# EAGLE schematic PT_2017_PB_4lyr_Rev1 (EAGLE 6.5.0)
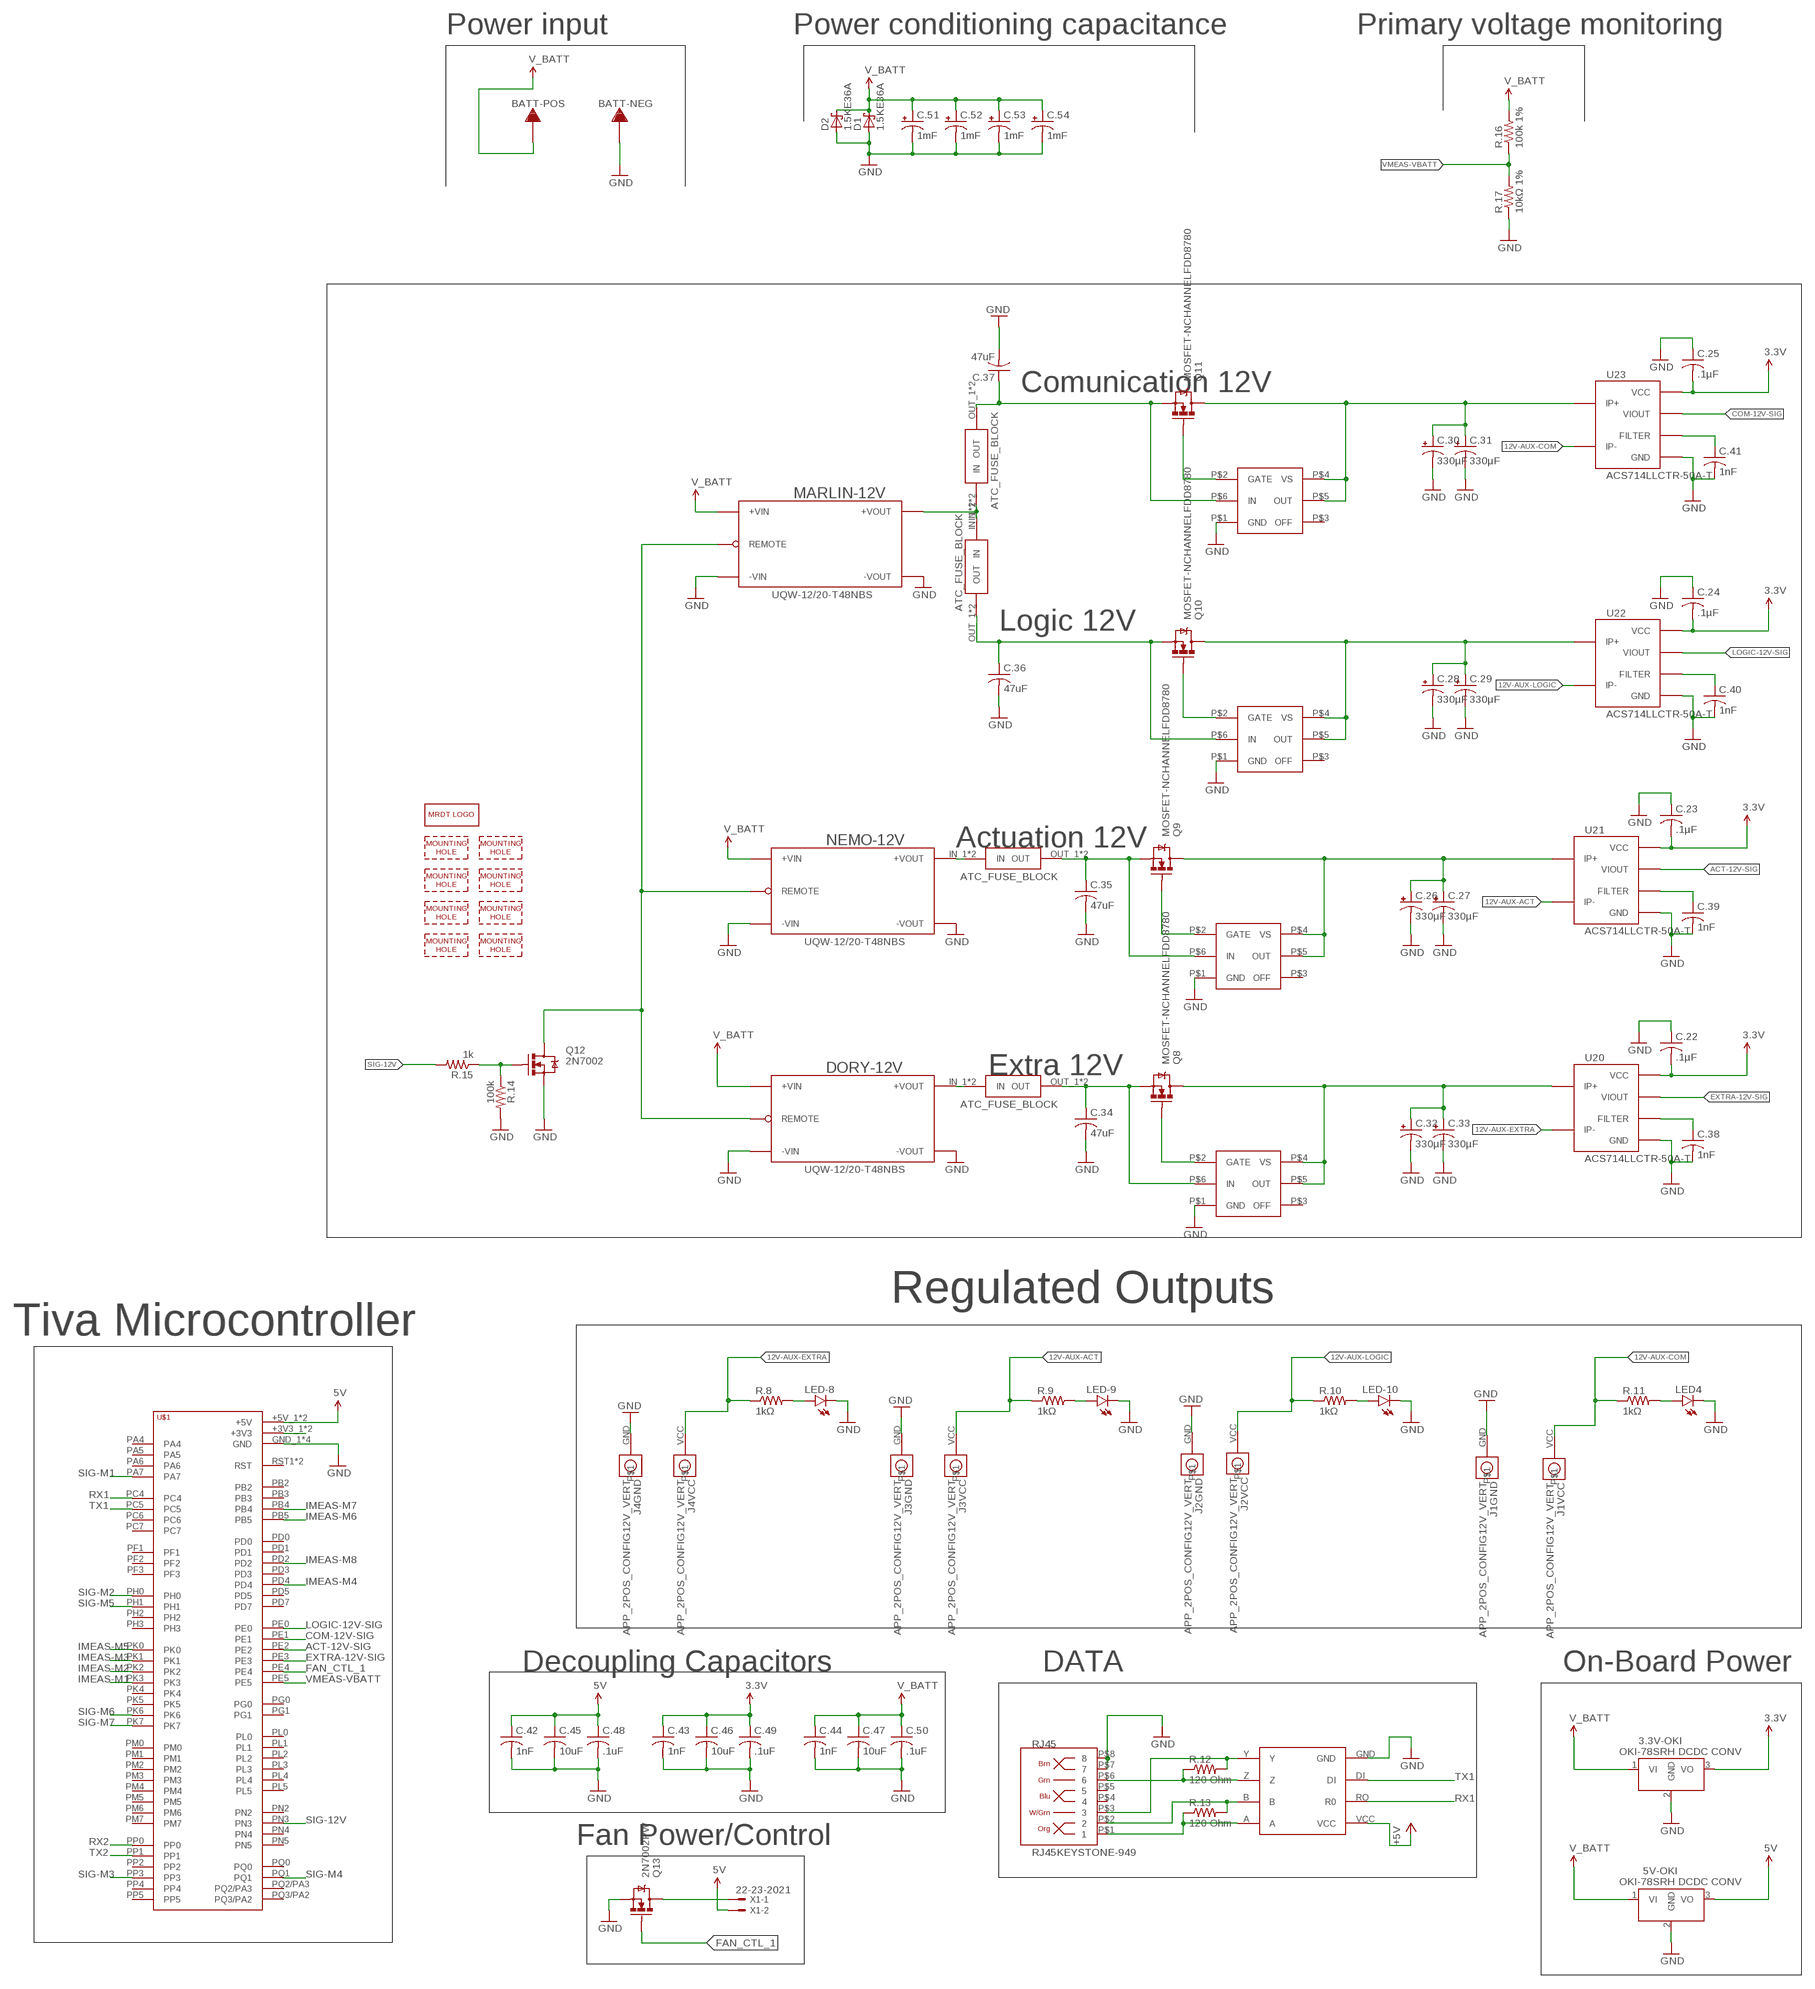
[diagram p0: schematic, sheet 1, part 1 of 2]
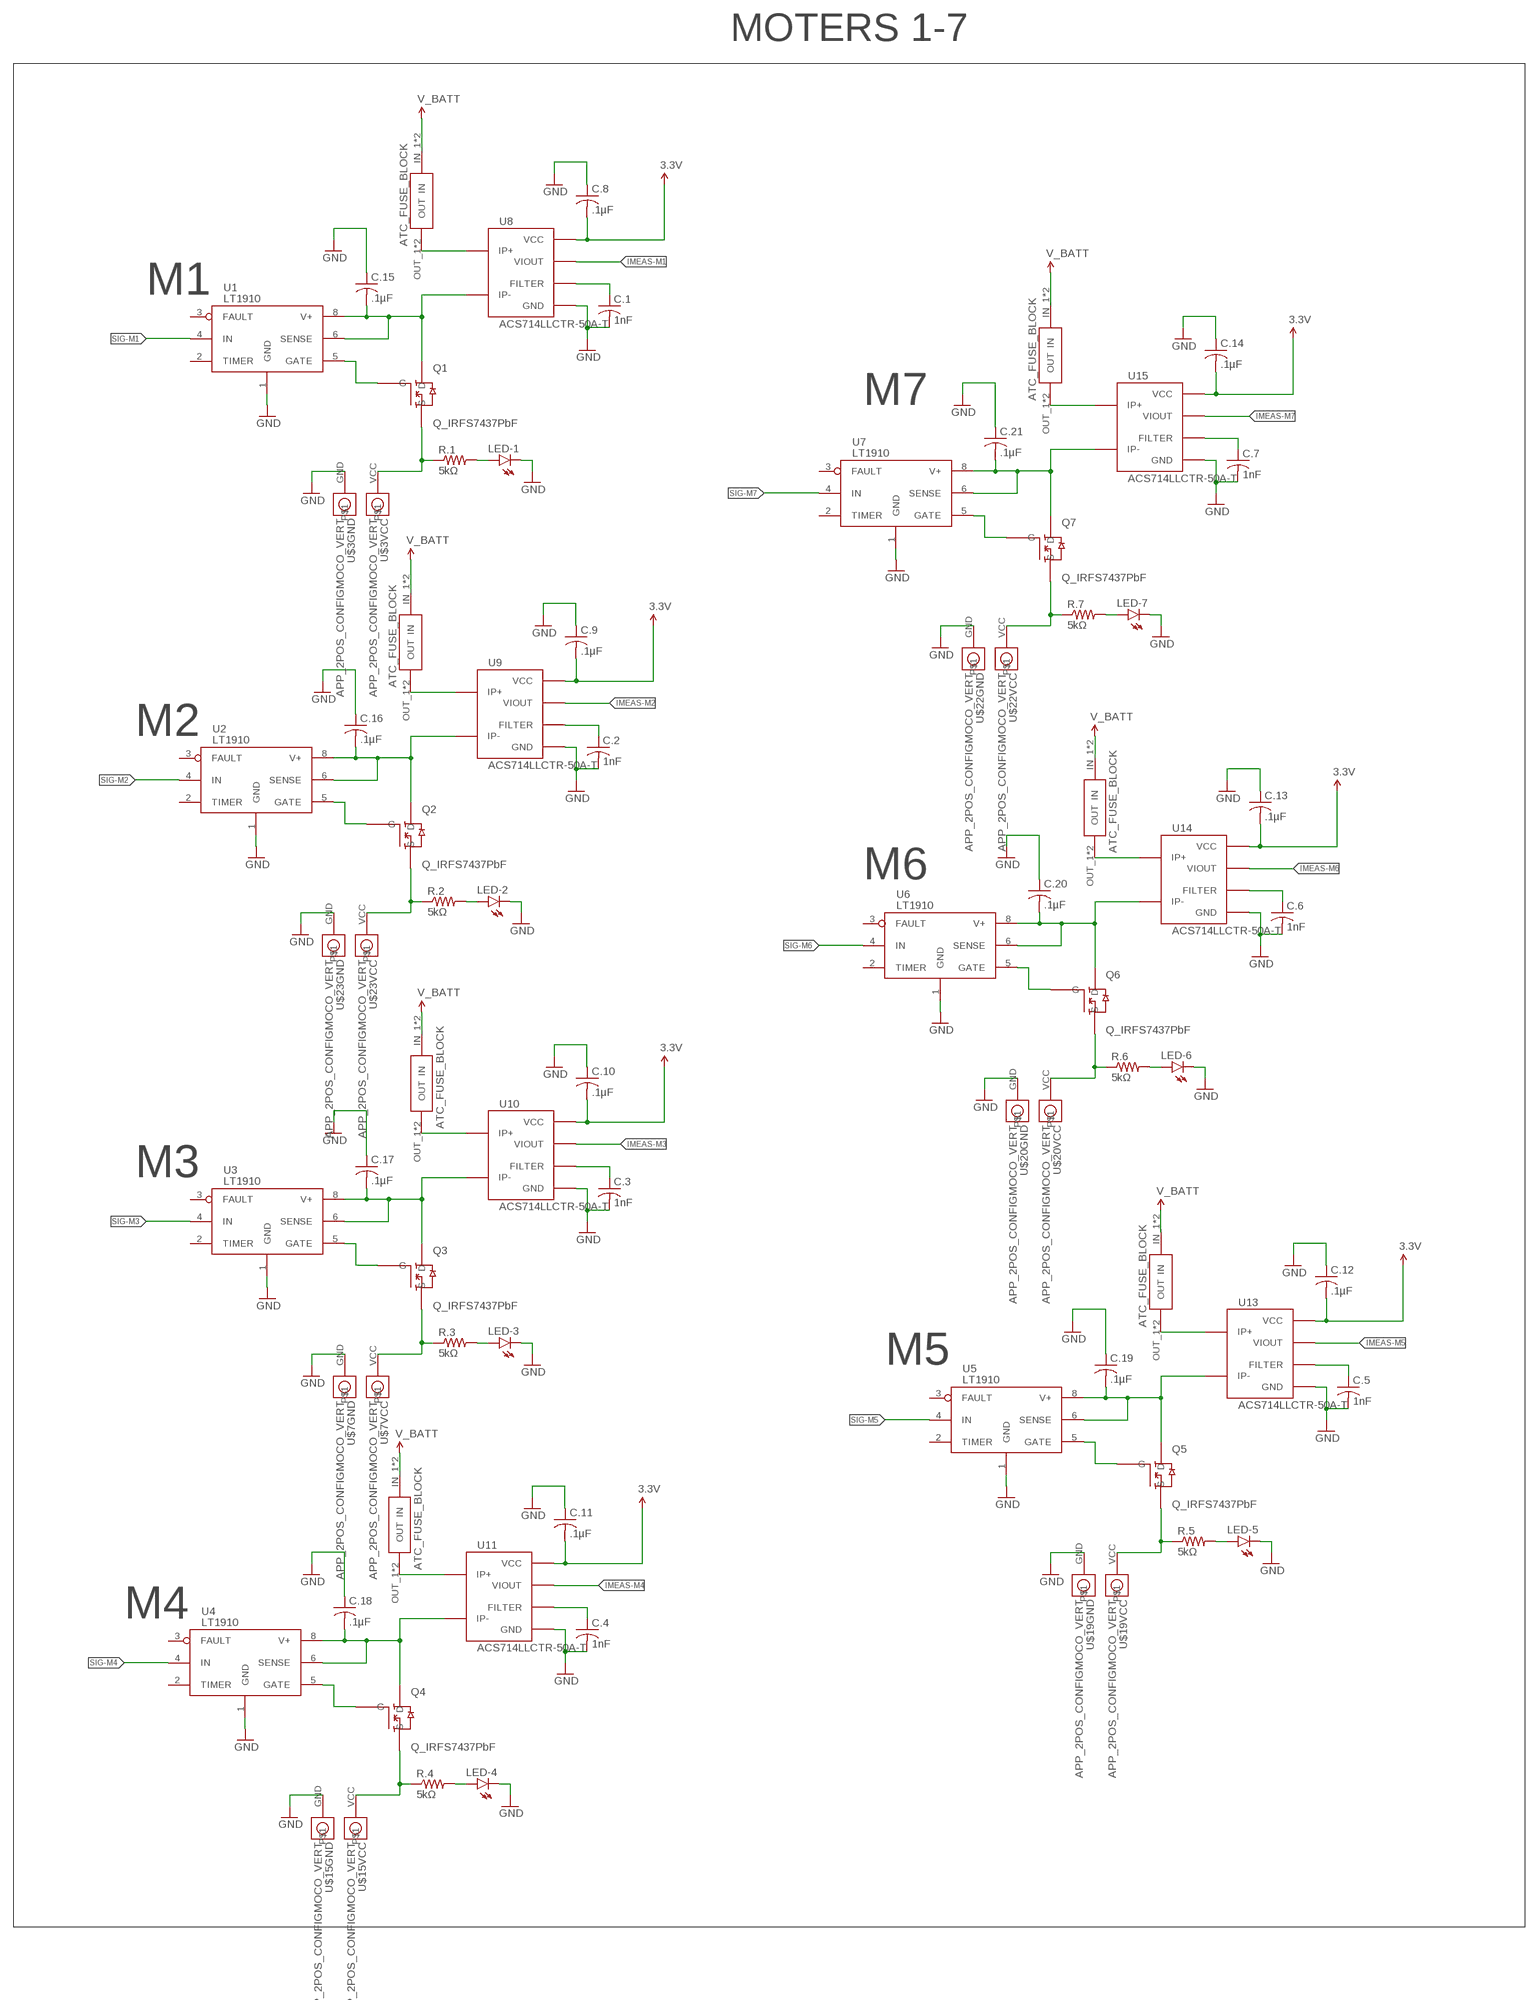
[diagram p1: schematic, sheet 1, part 2 of 2]

## Parts
3.3V-OKI  Q_OKI-78SR  [OKI-78SR_HORIZ]
5V-OKI  Q_OKI-78SR  [OKI-78SR_HORIZ]
BATT-NEG  TERMINAL_HOLE  [LARGE_TERMINAL_HOLE]
BATT-POS  TERMINAL_HOLE  [LARGE_TERMINAL_HOLE]
C.1  1nF  C-USC1206  [C1206]
C.2  1nF  C-USC1206  [C1206]
C.3  1nF  C-USC1206  [C1206]
C.4  1nF  C-USC1206  [C1206]
C.5  1nF  C-USC1206  [C1206]
C.6  1nF  C-USC1206  [C1206]
C.7  1nF  C-USC1206  [C1206]
C.8  .1µF  C-USC1206  [C1206]
C.9  .1µF  C-USC1206  [C1206]
C.10  .1µF  C-USC1206  [C1206]
C.11  .1µF  C-USC1206  [C1206]
C.12  .1µF  C-USC1206  [C1206]
C.13  .1µF  C-USC1206  [C1206]
C.14  .1µF  C-USC1206  [C1206]
C.15  .1µF  C-USC1206  [C1206]
C.16  .1µF  C-USC1206  [C1206]
C.17  .1µF  C-USC1206  [C1206]
C.18  .1µF  C-USC1206  [C1206]
C.19  .1µF  C-USC1206  [C1206]
C.20  .1µF  C-USC1206  [C1206]
C.21  .1µF  C-USC1206  [C1206]
C.22  .1µF  C-USC1206  [C1206]
C.23  .1µF  C-USC1206  [C1206]
C.24  .1µF  C-USC1206  [C1206]
C.25  .1µF  C-USC1206  [C1206]
C.26  330µF  CPOL-USE5-8.5  [E5-8,5]
C.27  330µF  CPOL-USE5-8.5  [E5-8,5]
C.28  330µF  CPOL-USE5-8.5  [E5-8,5]
C.29  330µF  CPOL-USE5-8.5  [E5-8,5]
C.30  330µF  CPOL-USE5-8.5  [E5-8,5]
C.31  330µF  CPOL-USE5-8.5  [E5-8,5]
C.32  330µF  CPOL-USE5-8.5  [E5-8,5]
C.33  330µF  CPOL-USE5-8.5  [E5-8,5]
C.34  47uF  C-USC1206  [C1206]
C.35  47uF  C-USC1206  [C1206]
C.36  47uF  C-USC1206  [C1206]
C.37  47uF  C-USC1206  [C1206]
C.38  1nF  C-USC1206  [C1206]
C.39  1nF  C-USC1206  [C1206]
C.40  1nF  C-USC1206  [C1206]
C.41  1nF  C-USC1206  [C1206]
C.42  1nF  C-USC1206  [C1206]
C.43  1nF  C-USC1206  [C1206]
C.44  1nF  C-USC1206  [C1206]
C.45  10uF  C-USC1206  [C1206]
C.46  10uF  C-USC1206  [C1206]
C.47  10uF  C-USC1206  [C1206]
C.48  .1uF  C-USC1206  [C1206]
C.49  .1uF  C-USC1206  [C1206]
C.50  .1uF  C-USC1206  [C1206]
C.51  1mF  C_POL12.5MM_NORMAL  [C_12.5MM]
C.52  1mF  C_POL12.5MM_NORMAL  [C_12.5MM]
C.53  1mF  C_POL12.5MM_NORMAL  [C_12.5MM]
C.54  1mF  C_POL12.5MM_NORMAL  [C_12.5MM]
D1  1.5KE36A  15KEXX  [CB429-17]
D2  1.5KE36A  15KEXX  [CB429-17]
DORY-12V  UQW-12/20-T48NBS  [U-T48-QB-NO_TRIM]
J1  APP_2POS_CONFIG12V_VERT  [APP45_12V_VERT_CONFIG]
J2  APP_2POS_CONFIG12V_VERT  [APP45_12V_VERT_CONFIG]
J3  APP_2POS_CONFIG12V_VERT  [APP45_12V_VERT_CONFIG]
J4  APP_2POS_CONFIG12V_VERT  [APP45_12V_VERT_CONFIG]
LED4  LED1206  [LED-1206]
LED-1  LED1206  [LED-1206]
LED-2  LED1206  [LED-1206]
LED-3  LED1206  [LED-1206]
LED-4  LED1206  [LED-1206]
LED-5  LED1206  [LED-1206]
LED-6  LED1206  [LED-1206]
LED-7  LED1206  [LED-1206]
LED-8  LED1206  [LED-1206]
LED-9  LED1206  [LED-1206]
LED-10  LED1206  [LED-1206]
MARLIN-12V  UQW-12/20-T48NBS  [U-T48-QB-NO_TRIM]
NEMO-12V  UQW-12/20-T48NBS  [U-T48-QB-NO_TRIM]
Q1  Q_IRFS7437PbF  Q_IRF7437SMD  [D2PACK]
Q2  Q_IRFS7437PbF  Q_IRF7437SMD  [D2PACK]
Q3  Q_IRFS7437PbF  Q_IRF7437SMD  [D2PACK]
Q4  Q_IRFS7437PbF  Q_IRF7437SMD  [D2PACK]
Q5  Q_IRFS7437PbF  Q_IRF7437SMD  [D2PACK]
Q6  Q_IRFS7437PbF  Q_IRF7437SMD  [D2PACK]
Q7  Q_IRFS7437PbF  Q_IRF7437SMD  [D2PACK]
Q8  MOSFET-NCHANNELFDD8780  [DPAK]
Q9  MOSFET-NCHANNELFDD8780  [DPAK]
Q10  MOSFET-NCHANNELFDD8780  [DPAK]
Q11  MOSFET-NCHANNELFDD8780  [DPAK]
Q12  2N7002  MOSFET-NCHANNEL2N7002PW  [SOT323]
Q13  2N7002PW  MOSFET-NCHANNEL2N7002PW  [SOT323]
R.1  5kΩ  RESISTOR1206  [1206]
R.2  5kΩ  RESISTOR1206  [1206]
R.3  5kΩ  RESISTOR1206  [1206]
R.4  5kΩ  RESISTOR1206  [1206]
R.5  5kΩ  RESISTOR1206  [1206]
R.6  5kΩ  RESISTOR1206  [1206]
R.7  5kΩ  RESISTOR1206  [1206]
R.8  1kΩ  RESISTOR1206  [1206]
R.9  1kΩ  RESISTOR1206  [1206]
R.10  1kΩ  RESISTOR1206  [1206]
R.11  1kΩ  RESISTOR1206  [1206]
R.12  120 Ohm  RESISTOR1206  [1206]
R.13  120 Ohm  RESISTOR1206  [1206]
R.14  100k  R-US_R1206  [R1206]
R.15  1k  R-US_R1206  [R1206]
R.16  100k 1%  R-US_R1206  [R1206]
R.17  10kΩ 1%  R-US_R1206  [R1206]
RJ45  RJ45KEYSTONE-949  [KEYSTONE-949]
U1  LT1910  [SO8]
U2  LT1910  [SO8]
U3  LT1910  [SO8]
U4  LT1910  [SO8]
U5  LT1910  [SO8]
U6  LT1910  [SO8]
U7  LT1910  [SO8]
U8  ACS714LLCTR-50A-T  Q_ACS714  [SOIC8_ACS711]
U9  ACS714LLCTR-50A-T  Q_ACS714  [SOIC8_ACS711]
U10  ACS714LLCTR-50A-T  Q_ACS714  [SOIC8_ACS711]
U11  ACS714LLCTR-50A-T  Q_ACS714  [SOIC8_ACS711]
U13  ACS714LLCTR-50A-T  Q_ACS714  [SOIC8_ACS711]
U14  ACS714LLCTR-50A-T  Q_ACS714  [SOIC8_ACS711]
U15  ACS714LLCTR-50A-T  Q_ACS714  [SOIC8_ACS711]
U16  LM5050  [LM5050]
U17  LM5050  [LM5050]
U18  LM5050  [LM5050]
U19  LM5050  [LM5050]
U20  ACS714LLCTR-50A-T  Q_ACS714  [SOIC8_ACS711]
U21  ACS714LLCTR-50A-T  Q_ACS714  [SOIC8_ACS711]
U22  ACS714LLCTR-50A-T  Q_ACS714  [SOIC8_ACS711]
U23  ACS714LLCTR-50A-T  Q_ACS714  [SOIC8_ACS711]
U24  MAX3077  [MAX3070E]
U$1  TIVA-C-CONNECTED  [TIVA-C-CONNECTED]
U$3  APP_2POS_CONFIGMOCO_VERT  [APP45_MOCO_VERT_CONFIG]
U$5  MOUNTING_HOLE#8  [#8_SCREW]
U$7  APP_2POS_CONFIGMOCO_VERT  [APP45_MOCO_VERT_CONFIG]
U$8  MOUNTING_HOLE#8  [#8_SCREW]
U$10  MOUNTING_HOLE#8  [#8_SCREW]
U$14  ATC_FUSE_BLOCK  [BLOCK_3557-2]
U$15  APP_2POS_CONFIGMOCO_VERT  [APP45_MOCO_VERT_CONFIG]
U$16  MOUNTING_HOLE#8  [#8_SCREW]
U$19  APP_2POS_CONFIGMOCO_VERT  [APP45_MOCO_VERT_CONFIG]
U$20  APP_2POS_CONFIGMOCO_VERT  [APP45_MOCO_VERT_CONFIG]
U$22  APP_2POS_CONFIGMOCO_VERT  [APP45_MOCO_VERT_CONFIG]
U$23  APP_2POS_CONFIGMOCO_VERT  [APP45_MOCO_VERT_CONFIG]
U$26  ATC_FUSE_BLOCK  [BLOCK_3557-2]
U$27  ATC_FUSE_BLOCK  [BLOCK_3557-2]
U$28  ATC_FUSE_BLOCK  [BLOCK_3557-2]
U$29  ATC_FUSE_BLOCK  [BLOCK_3557-2]
U$30  ATC_FUSE_BLOCK  [BLOCK_3557-2]
U$31  ATC_FUSE_BLOCK  [BLOCK_3557-2]
U$32  ATC_FUSE_BLOCK  [BLOCK_3557-2]
U$34  MOUNTING_HOLE#8  [#8_SCREW]
U$35  MOUNTING_HOLE#8  [#8_SCREW]
U$36  ATC_FUSE_BLOCK  [BLOCK_3557-2]
U$37  ATC_FUSE_BLOCK  [BLOCK_3557-2]
U$38  ATC_FUSE_BLOCK  [BLOCK_3557-2]
U$39  MOUNTING_HOLE#8  [#8_SCREW]
U$40  MOUNTING_HOLE#8  [#8_SCREW]
U$41  MRDT_LOGO  [MRDT_LOGO]
X1  22-23-2021  [22-23-2021]

## Nets
3.3V: 3.3V-OKI.3(VO) C.8.2 C.9.2 C.10.2 C.11.2 C.12.2 C.13.2 C.14.2 C.22.2 C.23.2 C.24.2 C.25.2 C.43.1 C.46.1 C.49.1 U8.8(VCC) U9.8(VCC) U10.8(VCC) U11.8(VCC) U13.8(VCC) U14.8(VCC) U15.8(VCC) U20.8(VCC) U21.8(VCC) U22.8(VCC) U23.8(VCC) U24.VCC ; supply symbol labelled +5V
5V: 5V-OKI.3(VO) C.42.1 C.45.1 C.48.1 U$1.+5V_1(+5V) U$1.+5V_2(+5V) X1.2
12V-AUX-ACT: J3.VCC R.9.1 U21.4(IP-)
12V-AUX-COM: J1.VCC R.11.1 U23.4(IP-)
12V-AUX-EXTRA: J4.VCC R.8.1 U20.4(IP-)
12V-AUX-LOGIC: J2.VCC R.10.1 U22.4(IP-)
ACT-12V-SIG: U21.7(VIOUT) U$1.PE2
COM-12V-SIG: U23.7(VIOUT) U$1.PE1
DRAIN-M1: C.15.2 Q1.TAB(D) U1.6(SENSE) U1.8(V+) U8.4(IP-)
DRAIN-M2: C.16.2 Q2.TAB(D) U2.6(SENSE) U2.8(V+) U9.4(IP-)
DRAIN-M3: C.17.2 Q3.TAB(D) U3.6(SENSE) U3.8(V+) U10.4(IP-)
DRAIN-M4: C.18.2 Q4.TAB(D) U4.6(SENSE) U4.8(V+) U11.4(IP-)
DRAIN-M5: C.19.2 Q5.TAB(D) U5.6(SENSE) U5.8(V+) U13.4(IP-)
DRAIN-M6: C.20.2 Q6.TAB(D) U6.6(SENSE) U6.8(V+) U14.4(IP-)
DRAIN-M7: C.21.2 Q7.TAB(D) U7.6(SENSE) U7.8(V+) U15.4(IP-)
EXTRA-12V-SIG: U20.7(VIOUT) U$1.PE3
FAN_CTL_1: Q13.1(G) U$1.PE4
FILTER-M1: C.1.1 U8.6(FILTER)
FILTER-M2: C.2.1 U9.6(FILTER)
FILTER-M3: C.3.1 U10.6(FILTER)
FILTER-M4: C.4.1 U11.6(FILTER)
FILTER-M5: C.5.1 U13.6(FILTER)
FILTER-M6: C.6.1 U14.6(FILTER)
FILTER-M7: C.7.1 U15.6(FILTER)
GATE-M1: Q1.1(G) U1.5(GATE)
GATE-M2: Q2.1(G) U2.5(GATE)
GATE-M3: Q3.1(G) U3.5(GATE)
GATE-M4: Q4.1(G) U4.5(GATE)
GATE-M5: Q5.1(G) U5.5(GATE)
GATE-M6: Q6.1(G) U6.5(GATE)
GATE-M7: Q7.1(G) U7.5(GATE)
GND: 3.3V-OKI.2(GND) 5V-OKI.2(GND) BATT-NEG.P$1 C.1.2 C.2.2 C.3.2 C.4.2 C.5.2 C.6.2 C.7.2 C.8.1 C.9.1 C.10.1 C.11.1 C.12.1 C.13.1 C.14.1 C.15.1 C.16.1 C.17.1 C.18.1 C.19.1 C.20.1 C.21.1 C.22.1 C.23.1 C.24.1 C.25.1 C.26.- C.27.- C.28.- C.29.- C.30.- C.31.- C.32.- C.33.- C.34.2 C.35.2 C.36.2 C.37.2 C.38.2 C.39.2 C.40.2 C.41.2 C.42.2 C.43.2 C.44.2 C.45.2 C.46.2 C.47.2 C.48.2 C.49.2 C.50.2 C.51.- C.52.- C.53.- C.54.- D1.A D2.A DORY-12V.3(-VIN) DORY-12V.4(-VOUT) J1.GND J2.GND J3.GND J4.GND LED4.C LED-1.C LED-2.C LED-3.C LED-4.C LED-5.C LED-6.C LED-7.C LED-8.C LED-9.C LED-10.C MARLIN-12V.3(-VIN) MARLIN-12V.4(-VOUT) NEMO-12V.3(-VIN) NEMO-12V.4(-VOUT) Q12.2(S) Q13.2(S) R.14.2 R.17.1 RJ45.P$7 RJ45.P$8 U1.1(GND) U2.1(GND) U3.1(GND) U4.1(GND) U5.1(GND) U6.1(GND) U7.1(GND) U8.5(GND) U9.5(GND) U10.5(GND) U11.5(GND) U13.5(GND) U14.5(GND) U15.5(GND) U16.P$1(GND) U17.P$1(GND) U18.P$1(GND) U19.P$1(GND) U20.5(GND) U21.5(GND) U22.5(GND) U23.5(GND) U24.GND U$1.GND_1(GND) U$1.GND_2(GND) U$1.GND_3(GND) U$1.GND_4(GND) U$3.GND U$7.GND U$15.GND U$19.GND U$20.GND U$22.GND U$23.GND
IMEAS-M1: U8.7(VIOUT) U$1.PK3
IMEAS-M2: U9.7(VIOUT) U$1.PK2
IMEAS-M3: U10.7(VIOUT) U$1.PK1
IMEAS-M4: U11.7(VIOUT) U$1.PD4
IMEAS-M5: U13.7(VIOUT) U$1.PK0
IMEAS-M6: U14.7(VIOUT) U$1.PB5
IMEAS-M7: U15.7(VIOUT) U$1.PB4
IMEAS-M8: U$1.PD2
LEDLINE-M1: LED-1.A R.1.2
LEDLINE-M2: LED-2.A R.2.2
LEDLINE-M3: LED-3.A R.3.2
LEDLINE-M4: LED-4.A R.4.2
LEDLINE-M5: LED-5.A R.5.2
LEDLINE-M6: LED-6.A R.6.2
LEDLINE-M7: LED-7.A R.7.2
LOGIC-12V-SIG: U22.7(VIOUT) U$1.PE0
N$1: C.35.1 Q9.3(S) U17.P$6(IN) U$30.OUT_1(OUT) U$30.OUT_2(OUT)
N$2: C.34.1 Q8.3(S) U16.P$6(IN) U$14.OUT_1(OUT) U$14.OUT_2(OUT)
N$3: Q9.1(G) U17.P$2(GATE)
N$4: C.41.1 U23.6(FILTER)
N$5: Q8.1(G) U16.P$2(GATE)
N$6: LED-9.A R.9.2
N$7: LED-10.A R.10.2
N$8: DORY-12V.2(REMOTE) MARLIN-12V.2(REMOTE) NEMO-12V.2(REMOTE) Q12.3(D)
N$9: C.37.1 Q11.3(S) U19.P$6(IN) U$32.OUT_1(OUT) U$32.OUT_2(OUT)
N$10: C.38.1 U20.6(FILTER)
N$11: C.32.+ C.33.+ Q8.4(D) U16.P$4(VS) U16.P$5(OUT) U20.1(IP+)
N$12: C.39.1 U21.6(FILTER)
N$13: C.36.1 Q10.3(S) U18.P$6(IN) U$31.OUT_1(OUT) U$31.OUT_2(OUT)
N$14: C.26.+ C.27.+ Q9.4(D) U17.P$4(VS) U17.P$5(OUT) U21.1(IP+)
N$15: C.40.1 U22.6(FILTER)
N$16: LED4.A R.11.2
N$17: Q10.1(G) U18.P$2(GATE)
N$19: C.28.+ C.29.+ Q10.4(D) U18.P$4(VS) U18.P$5(OUT) U22.1(IP+)
N$20: Q11.1(G) U19.P$2(GATE)
N$21: NEMO-12V.8(+VOUT) U$30.IN_1(IN) U$30.IN_2(IN)
N$22: C.30.+ C.31.+ Q11.4(D) U19.P$4(VS) U19.P$5(OUT) U23.1(IP+)
N$23: DORY-12V.8(+VOUT) U$14.IN_1(IN) U$14.IN_2(IN)
N$24: MARLIN-12V.8(+VOUT) U$31.IN_1(IN) U$31.IN_2(IN) U$32.IN_1(IN) U$32.IN_2(IN)
N$46: LED-8.A R.8.2
N$66: Q13.3(D) X1.1
N$98: U$1.+3V3_1(+3V3) U$1.+3V3_2(+3V3)
N$114: Q12.1(G) R.14.1 R.15.1
REC+1: R.13.1 RJ45.P$1 U24.A
REC-1: R.13.2 RJ45.P$2 U24.B
RX1: U24.RO(R0) U$1.PC4
RX2: U$1.PP0
SIG-12V: R.15.2 U$1.PN3
SIG-M1: U1.4(IN) U$1.PA7
SIG-M2: U2.4(IN) U$1.PH0
SIG-M3: U3.4(IN) U$1.PP3
SIG-M4: U4.4(IN) U$1.PQ1
SIG-M5: U5.4(IN) U$1.PH1
SIG-M6: U6.4(IN) U$1.PK6
SIG-M7: U7.4(IN) U$1.PK7
SOURCE-M1: Q1.2(S) R.1.1 U$3.VCC
SOURCE-M2: Q2.2(S) R.2.1 U$23.VCC
SOURCE-M3: Q3.2(S) R.3.1 U$7.VCC
SOURCE-M4: Q4.2(S) R.4.1 U$15.VCC
SOURCE-M5: Q5.2(S) R.5.1 U$19.VCC
SOURCE-M6: Q6.2(S) R.6.1 U$20.VCC
SOURCE-M7: Q7.2(S) R.7.1 U$22.VCC
TRANS+1: R.12.2 RJ45.P$3 U24.Y
TRANS-1: R.12.1 RJ45.P$6 U24.Z
TX1: U24.DI U$1.PC5
TX2: U$1.PP1
V_BATT: 3.3V-OKI.1(VI) 5V-OKI.1(VI) BATT-POS.P$1 C.44.1 C.47.1 C.50.1 C.51.+ C.52.+ C.53.+ C.54.+ D1.C D2.C DORY-12V.1(+VIN) MARLIN-12V.1(+VIN) NEMO-12V.1(+VIN) R.16.2 U$26.IN_1(IN) U$26.IN_2(IN) U$27.IN_1(IN) U$27.IN_2(IN) U$28.IN_1(IN) U$28.IN_2(IN) U$29.IN_1(IN) U$29.IN_2(IN) U$36.IN_1(IN) U$36.IN_2(IN) U$37.IN_1(IN) U$37.IN_2(IN) U$38.IN_1(IN) U$38.IN_2(IN)
V_BATT_M1: U8.1(IP+) U$26.OUT_1(OUT) U$26.OUT_2(OUT)
V_BATT_M2: U9.1(IP+) U$27.OUT_1(OUT) U$27.OUT_2(OUT)
V_BATT_M3: U10.1(IP+) U$36.OUT_1(OUT) U$36.OUT_2(OUT)
V_BATT_M4: U11.1(IP+) U$37.OUT_1(OUT) U$37.OUT_2(OUT)
V_BATT_M5: U13.1(IP+) U$38.OUT_1(OUT) U$38.OUT_2(OUT)
V_BATT_M6: U14.1(IP+) U$29.OUT_1(OUT) U$29.OUT_2(OUT)
V_BATT_M7: U15.1(IP+) U$28.OUT_1(OUT) U$28.OUT_2(OUT)
VMEAS-VBATT: R.16.1 R.17.2 U$1.PE5
Unconnected: RJ45.P$4 RJ45.P$5 U1.2(TIMER) U1.3(FAULT) U2.2(TIMER) U2.3(FAULT) U3.2(TIMER) U3.3(FAULT) U4.2(TIMER) U4.3(FAULT) U5.2(TIMER) U5.3(FAULT) U6.2(TIMER) U6.3(FAULT) U7.2(TIMER) U7.3(FAULT) U16.P$3(OFF) U17.P$3(OFF) U18.P$3(OFF) U19.P$3(OFF) U$1.PA4 U$1.PA5 U$1.PA6 U$1.PB2 U$1.PB3 U$1.PC6 U$1.PC7 U$1.PD0 U$1.PD1 U$1.PD3 U$1.PD5 U$1.PD7 U$1.PF1 U$1.PF2 U$1.PF3 U$1.PG0 U$1.PG1 U$1.PH2 U$1.PH3 U$1.PK4 U$1.PK5 U$1.PL0 U$1.PL1 U$1.PL2 U$1.PL3 U$1.PL4 U$1.PL5 U$1.PM0 U$1.PM1 U$1.PM2 U$1.PM3 U$1.PM4 U$1.PM5 U$1.PM6 U$1.PM7 U$1.PN2 U$1.PN4 U$1.PN5 U$1.PP2 U$1.PP4 U$1.PP5 U$1.PQ0 U$1.PQ2/PA3 U$1.PQ3/PA2 U$1.RST1(RST) U$1.RST_2(RST)

## Notes on the sheet
- Power input | Power conditioning capacitance | Primary voltage monitoring
- MOTERS 1-7
- M1
- Comunication 12V
- M7
- Logic 12V
- M2
- Actuation 12V
- M6
- Extra 12V
- M3
- Regulated Outputs
- Tiva Microcontroller
- M5
- Decoupling Capacitors | DATA | On-Board Power | M4
- Fan Power/Control

## Library data of the parts
3.3V-OKI 5V-OKI = MRDT-2015-PowerBoard:Q_OKI-78SR: 4.95W DC/DC Converter Manufacturer: Murata Part Number: OKI-78SR-5/1.5-W36H-C OKI-78SR-3.3/1.5-W36H-C
BATT-NEG BATT-POS = MRDT-2015-PowerBoard:TERMINAL_HOLE
C.1-C.25 C.34-C.50 = resistor:C-US: CAPACITOR, American symbol
C.26-C.33 = resistor:CPOL-US: POLARIZED CAPACITOR, American symbol
C.51-C.54 = MRDT-2014-All:C_POL: Alum Elect. Cap with 10mm diameter, 5mm lead spacing and 0.7mm lead diameter
D1 D2 = diode:15KEXX: DIODE
DORY-12V MARLIN-12V NEMO-12V = MRDT-2015-PowerBoard:UQW-12/20-T48NBS
J1-J4 = MRDT-Connectors:APP_2POS_CONFIG; COLOR1: YELLOW; COLOR2: BLACK
LED4 LED-1-LED-10 = SparkFun-LED:LED: LEDs Standard schematic elements and footprints for 5mm, 3mm, 1206, and 0603 sized LEDs. 5mm - Spark Fun Electronics SKU : COM-00529 (and others)
Q1-Q7 = MRDT-2015-PowerBoard:Q_IRF*7437: 40V 195A N-CH MOSFET switch with heatsink
Q8-Q11 = SparkFun-DiscreteSemi:MOSFET-NCHANNEL: Common NMOSFET Parts MFG P/N Store ID Prod ID FDD8780 TRANS-09984 SI7820DN TRANS-11055 FDS6630A IC-08089 2N7002PW TRANS-11151 FQP30N06L COM-10213 TRANS-10060 BSS123LT1G TRANS-08345 BSS138 TRANS-00830 BS170 2N7000; PROD_ID: TRANS-09984
Q12 Q13 = SparkFun-DiscreteSemi:MOSFET-NCHANNEL: Common NMOSFET Parts MFG P/N Store ID Prod ID FDD8780 TRANS-09984 SI7820DN TRANS-11055 FDS6630A IC-08089 2N7002PW TRANS-11151 FQP30N06L COM-10213 TRANS-10060 BSS123LT1G TRANS-08345 BSS138 TRANS-00830 BS170 2N7000; PROD_ID: TRANS-11151
R.1-R.13 = SparkFun-Passives:RESISTOR: Resistor Basic schematic elements and footprints for 0603, 1206, and PTH resistors.
R.14-R.17 = resistor:R-US_: RESISTOR, American symbol
RJ45 = MRDT-2015-General:RJ45
U1-U7 = Jake:LT1910
U8-U11 U13-U15 U20-U23 = MRDT-2015-PowerBoard:Q_ACS714: Sketch variant has increased clearance for traces.
U16-U19 = LM5050:LM5050
U24 = MAX3077:MAX3077
U$1 = MRDT-2015-General:TIVA-C-CONNECTED: TIVA C CONNECTED LAUNCHPAD
U$3 U$7 U$15 U$19 U$20 U$22 U$23 = MRDT-Connectors:APP_2POS_CONFIG; COLOR2: BLACK
U$5 U$8 U$10 U$16 U$34 U$35 U$39 U$40 = MRDT-Hardware:MOUNTING_HOLE: Mounting hole for M6 bolt. Standard use mounting hole for: Tiva C Connected - M6 Anderson Powerpole Mounting Wing - M8 Most frame-mounted PCB's - M8
U$14 U$26-U$32 U$36-U$38 = MRDT-Hardware:ATC_FUSE_BLOCK: FUSE BLOCK BLADE 500V 30A PCB - Part#36-3557-2-ND on Digikey
U$41 = MRDT-2015-General:MRDT_LOGO
X1 = con-molex:22-23-2021: .100" (2.54mm) Center Header - 2 Pin; MF: MOLEX; MPN: 22-23-2021; OC_FARNELL: 1462926; OC_NEWARK: 25C3832

## Net classes
0 default: clearance 0.205 mm